# Altium schematic sheet FPGA_part.SchDoc
size A4
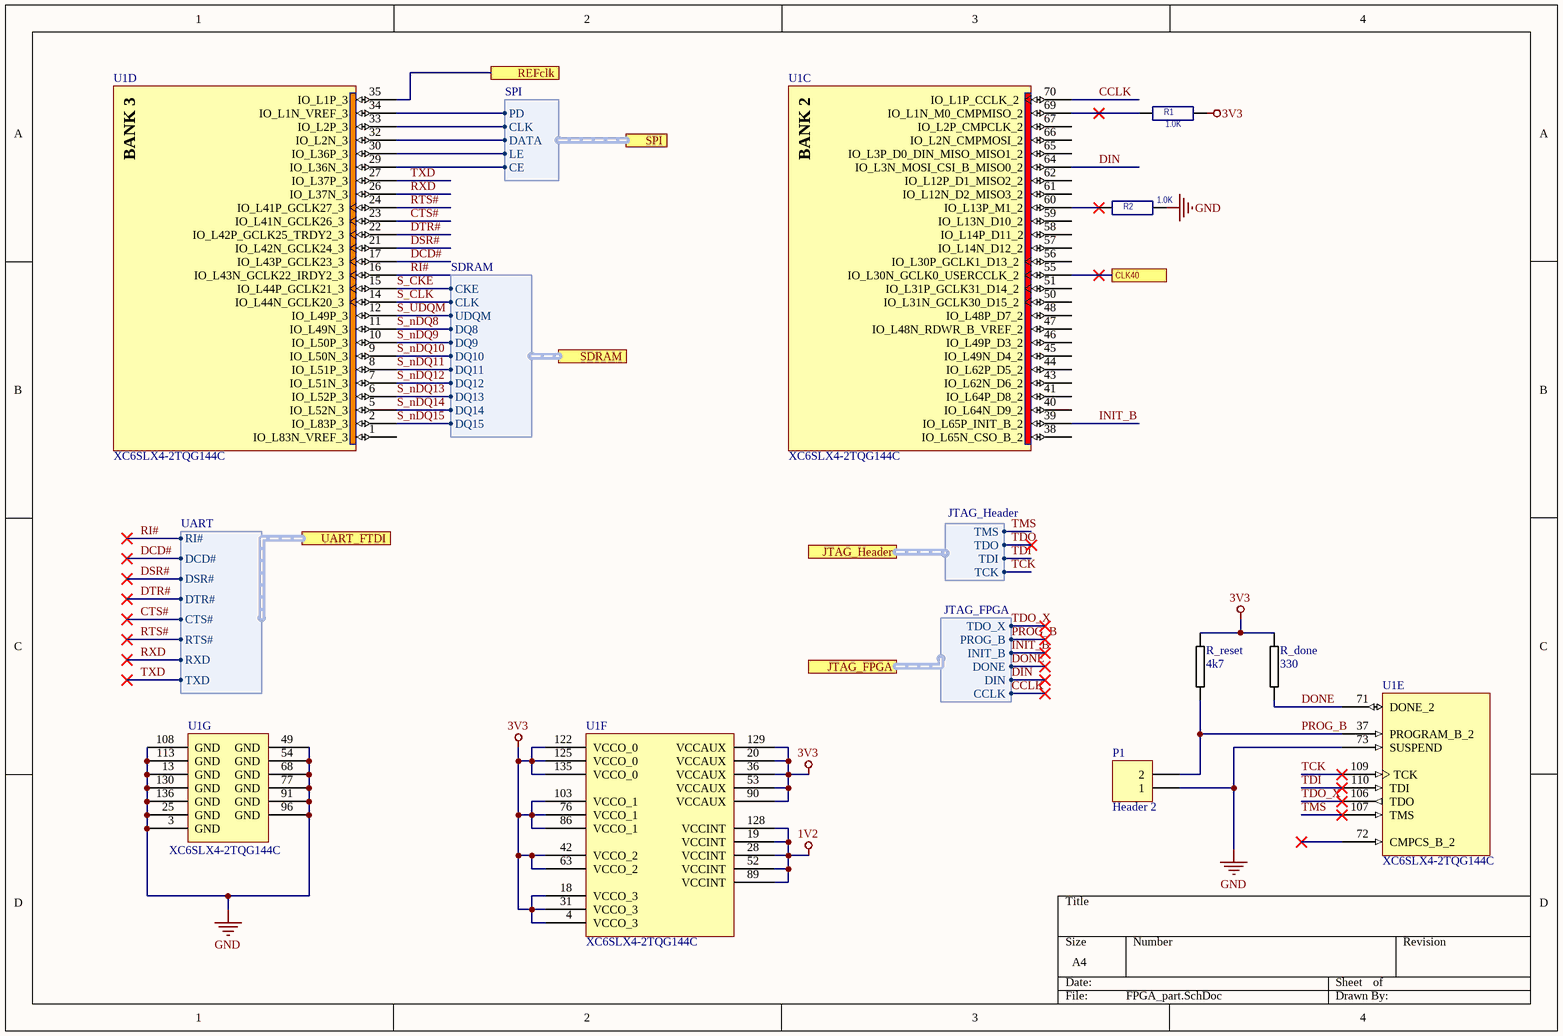
[diagram p0: FPGA_part.SchDoc]

## Parts
P1  Header 2  [HDR1X2]
R1  1.0K  [R0603]
R2  1.0K  [R0603]
R_done  330  [0603R-TBD]
R_reset  4k7  [0603R-TBD]
U1  XC6SLX4-2TQG144C  [TQG144_L]  (parts C,D,E,F,G of 7)

## Ports
CLK40, JTAG_FPGA (harness JTAG_FPGA), JTAG_Header (harness JTAG_Header), REFclk, SDRAM (harness SDRAM), SPI (harness SPI), UART_FTDI (harness UART)

## Harnesses
JTAG_Header: TCK, TDI, TDO, TMS
JTAG_FPGA: CCLK, DIN, DONE, INIT_B, PROG_B, TDO_X
UART: TXD, RXD, RTS#, CTS#, DTR#, DSR#, DCD#, RI#
SDRAM: CKE, CLK, DQ10, DQ11, DQ12, DQ13, DQ14, DQ15, DQ8, DQ9, UDQM
SPI: CE, CLK, DATA, LE, PD

## Nets
1V2: U1.19(VCCINT) U1.28(VCCINT) U1.52(VCCINT) U1.89(VCCINT) U1.128(VCCINT)
3V3: R1.2 R_done.1 R_reset.1 U1.4(VCCO_3) U1.18(VCCO_3) U1.20(VCCAUX) U1.31(VCCO_3) U1.36(VCCAUX) U1.42(VCCO_2) U1.53(VCCAUX) U1.63(VCCO_2) U1.76(VCCO_1) U1.86(VCCO_1) U1.90(VCCAUX) U1.103(VCCO_1) U1.122(VCCO_0) U1.125(VCCO_0) U1.129(VCCAUX) U1.135(VCCO_0)
GND: P1.1 R2.2 U1.3(GND) U1.13(GND) U1.25(GND) U1.49(GND) U1.54(GND) U1.68(GND) U1.73(SUSPEND) U1.77(GND) U1.91(GND) U1.96(GND) U1.108(GND) U1.113(GND) U1.130(GND) U1.136(GND)
CCLK: U1.70(IO_L1P_CCLK_2) ; port JTAG_FPGA.CCLK
CLK40: U1.55(IO_L30N_GCLK0_USERCCLK_2) ; port CLK40
CTS#: U1.23(IO_L41N_GCLK26_3) ; port UART_FTDI.CTS#
DCD#: U1.17(IO_L43P_GCLK23_3) ; port UART_FTDI.DCD#
DIN: U1.64(IO_L3N_MOSI_CSI_B_MISO0_2) ; port JTAG_FPGA.DIN
DONE: R_done.2 U1.71(DONE_2) ; port JTAG_FPGA.DONE
DSR#: U1.21(IO_L42N_GCLK24_3) ; port UART_FTDI.DSR#
DTR#: U1.22(IO_L42P_GCLK25_TRDY2_3) ; port UART_FTDI.DTR#
INIT_B: U1.39(IO_L65P_INIT_B_2) ; port JTAG_FPGA.INIT_B
PROG_B: P1.2 R_reset.2 U1.37(PROGRAM_B_2) ; port JTAG_FPGA.PROG_B
REFclk: U1.35(IO_L1P_3) ; port REFclk
RI#: U1.16(IO_L43N_GCLK22_IRDY2_3) ; port UART_FTDI.RI#
RTS#: U1.24(IO_L41P_GCLK27_3) ; port UART_FTDI.RTS#
RXD: U1.26(IO_L37N_3) ; port UART_FTDI.RXD
S_CKE: U1.15(IO_L44P_GCLK21_3) ; port SDRAM.CKE
S_CLK: U1.14(IO_L44N_GCLK20_3) ; port SDRAM.CLK
S_nDQ8: U1.11(IO_L49N_3) ; port SDRAM.DQ8
S_nDQ9: U1.10(IO_L50P_3) ; port SDRAM.DQ9
S_nDQ10: U1.9(IO_L50N_3) ; port SDRAM.DQ10
S_nDQ11: U1.8(IO_L51P_3) ; port SDRAM.DQ11
S_nDQ12: U1.7(IO_L51N_3) ; port SDRAM.DQ12
S_nDQ13: U1.6(IO_L52P_3) ; port SDRAM.DQ13
S_nDQ14: U1.5(IO_L52N_3) ; port SDRAM.DQ14
S_nDQ15: U1.2(IO_L83P_3) ; port SDRAM.DQ15
S_UDQM: U1.12(IO_L49P_3) ; port SDRAM.UDQM
TCK: U1.109(TCK) ; port JTAG_Header.TCK
TDI: U1.110(TDI) ; port JTAG_Header.TDI
TDO: port JTAG_Header.TDO
TDO_X: U1.106(TDO) ; port JTAG_FPGA.TDO_X
TMS: U1.107(TMS) ; port JTAG_Header.TMS
TXD: U1.27(IO_L37P_3) ; port UART_FTDI.TXD
NetR1_1: R1.1 U1.69(IO_L1N_M0_CMPMISO_2)
NetR2_1: R2.1 U1.60(IO_L13P_M1_2)
NetU1_29: U1.29(IO_L36N_3) ; port SPI.CE
NetU1_30: U1.30(IO_L36P_3) ; port SPI.LE
NetU1_32: U1.32(IO_L2N_3) ; port SPI.DATA
NetU1_33: U1.33(IO_L2P_3) ; port SPI.CLK
NetU1_34: U1.34(IO_L1N_VREF_3) ; port SPI.PD

Not connected (* = marked no-connect by the designer): U1 1(IO_L83N_VREF_3) 38(IO_L65N_CSO_B_2) 40(IO_L64N_D9_2) 41(IO_L64P_D8_2) 43(IO_L62N_D6_2) 44(IO_L62P_D5_2) 45(IO_L49N_D4_2) 46(IO_L49P_D3_2) 47(IO_L48N_RDWR_B_VREF_2) 48(IO_L48P_D7_2) 50(IO_L31N_GCLK30_D15_2) 51(IO_L31P_GCLK31_D14_2) 56(IO_L30P_GCLK1_D13_2) 57(IO_L14N_D12_2) 58(IO_L14P_D11_2) 59(IO_L13N_D10_2) 61(IO_L12N_D2_MISO3_2) 62(IO_L12P_D1_MISO2_2) 65(IO_L3P_D0_DIN_MISO_MISO1_2) 66(IO_L2N_CMPMOSI_2) 67(IO_L2P_CMPCLK_2) 72(CMPCS_B_2)*

## Notes on the sheet
- (in symbol XC6SLX4-2TQG144C, part C) BANK 2
- (in symbol XC6SLX4-2TQG144C, part D) BANK 3

## Library data of the parts
P1 = Header 2: Header, 2-Pin; LatestRevisionDate: 17-Jul-2002; LatestRevisionNote: Re-released for DXP Platform.; Publisher: Altium Limited
R1 R2 = 1.0K_0603_0.063W_5%: 923-3385    RESISTOR MF_0603_1.0KR_0.063W_5%_50V; 232270260102; PHYCOMP; RoHS=Yes
R_done R_reset = 0603R-TBD: RESISTOR 0603 VALUE TO BE DETERMINED
U1 = XC6SLX4-2TQG144C: Spartan-6 LX 1.2V FPGA, 102 User I/Os, 144-Pin TQFP (0.5mm Pitch), Speed Grade 2, Commercial Grade, Pb-Free; Published: 1-Jul-2010; DatasheetVersion: ver1.6, Nov-2010; PackageVersion: ver1.2, Jun-2004; PackageReference: TQG144; Publisher: Altium Limited; PackageDescription: 144-Pin Thin Quad Flat Pack (TQG144) - Pb-Free; Supplier 1: Digi-Key; Supplier Part Number 1: XC6SLX4-2TQG144C-ND; Code_JEDEC: MS-026-BFB; ComponentLink1Description: Manufacturer Link; ComponentLink1URL: http://www.xilinx.com; ComponentLink2Description: Spartan-6 Datasheet; ComponentLink2URL: http://www.xilinx.com/support/documentation/data_sheets/ds160.pdf; ComponentLink3Description: Spartan-6 Documents; ComponentLink3URL: http://www.xilinx.com/support/documentation/spartan-6.htm; ComponentLink4Description: Xilinx.com Home; ComponentLink4URL: http://www.xilinx.com